# Altium schematic sheet Schematics.SchDoc
size A4; SheetNumber: 1; SheetTotal: 1
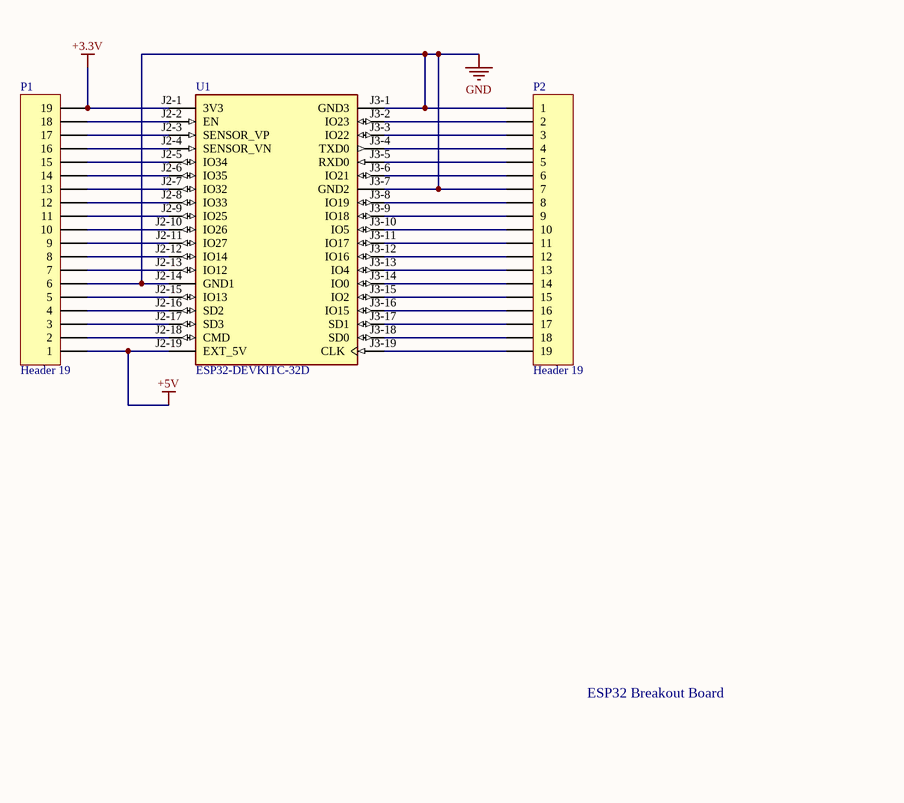
[diagram p0: Schematics.SchDoc]

## Parts
P1  Header 19  [HDR1X19]
P2  Header 19  [HDR1X19]
U1  ESP32-DEVKITC-32D  [MODULE_ESP32-DEVKITC-32D]

## Nets
+3.3V: P1.19 U1.J2-1(3V3)
+5V: P1.1 U1.J2-19(EXT_5V)
GND: P1.6 P2.1 P2.7 U1.J2-14(GND1) U1.J3-1(GND3) U1.J3-7(GND2)
NetP1_2: P1.2 U1.J2-18(CMD)
NetP1_3: P1.3 U1.J2-17(SD3)
NetP1_4: P1.4 U1.J2-16(SD2)
NetP1_5: P1.5 U1.J2-15(IO13)
NetP1_7: P1.7 U1.J2-13(IO12)
NetP1_8: P1.8 U1.J2-12(IO14)
NetP1_9: P1.9 U1.J2-11(IO27)
NetP1_10: P1.10 U1.J2-10(IO26)
NetP1_11: P1.11 U1.J2-9(IO25)
NetP1_12: P1.12 U1.J2-8(IO33)
NetP1_13: P1.13 U1.J2-7(IO32)
NetP1_14: P1.14 U1.J2-6(IO35)
NetP1_15: P1.15 U1.J2-5(IO34)
NetP1_16: P1.16 U1.J2-4(SENSOR_VN)
NetP1_17: P1.17 U1.J2-3(SENSOR_VP)
NetP1_18: P1.18 U1.J2-2(EN)
NetP2_2: P2.2 U1.J3-2(IO23)
NetP2_3: P2.3 U1.J3-3(IO22)
NetP2_4: P2.4 U1.J3-4(TXD0)
NetP2_5: P2.5 U1.J3-5(RXD0)
NetP2_6: P2.6 U1.J3-6(IO21)
NetP2_8: P2.8 U1.J3-8(IO19)
NetP2_9: P2.9 U1.J3-9(IO18)
NetP2_10: P2.10 U1.J3-10(IO5)
NetP2_11: P2.11 U1.J3-11(IO17)
NetP2_12: P2.12 U1.J3-12(IO16)
NetP2_13: P2.13 U1.J3-13(IO4)
NetP2_14: P2.14 U1.J3-14(IO0)
NetP2_15: P2.15 U1.J3-15(IO2)
NetP2_16: P2.16 U1.J3-16(IO15)
NetP2_17: P2.17 U1.J3-17(SD1)
NetP2_18: P2.18 U1.J3-18(SD0)
NetP2_19: P2.19 U1.J3-19(CLK)

## Notes on the sheet
- ESP32 Breakout Board

## Library data of the parts
P1 P2 = Header 19: Header, 19-Pin; LatestRevisionDate: 17-Jul-2002; LatestRevisionNote: Re-released for DXP Platform.; Publisher: Altium Limited
U1 = ESP32-DEVKITC-32D: WiFi Development Tools (802.11) ESP32 General Development Kit, ESP32-WROOM-32D on the board; MF: Espressif Systems; SnapEDA_Link: https://www.snapeda.com/parts/ESP32-DEVKITC-32D/Espressif+Systems/view-part/?ref=snap; Package: None; Value: *; MP: ESP32-DEVKITC-32D; Check_prices: https://www.snapeda.com/parts/ESP32-DEVKITC-32D/Espressif+Systems/view-part/?ref=eda